# Altium schematic sheet FullSystem.SchDoc
size A1
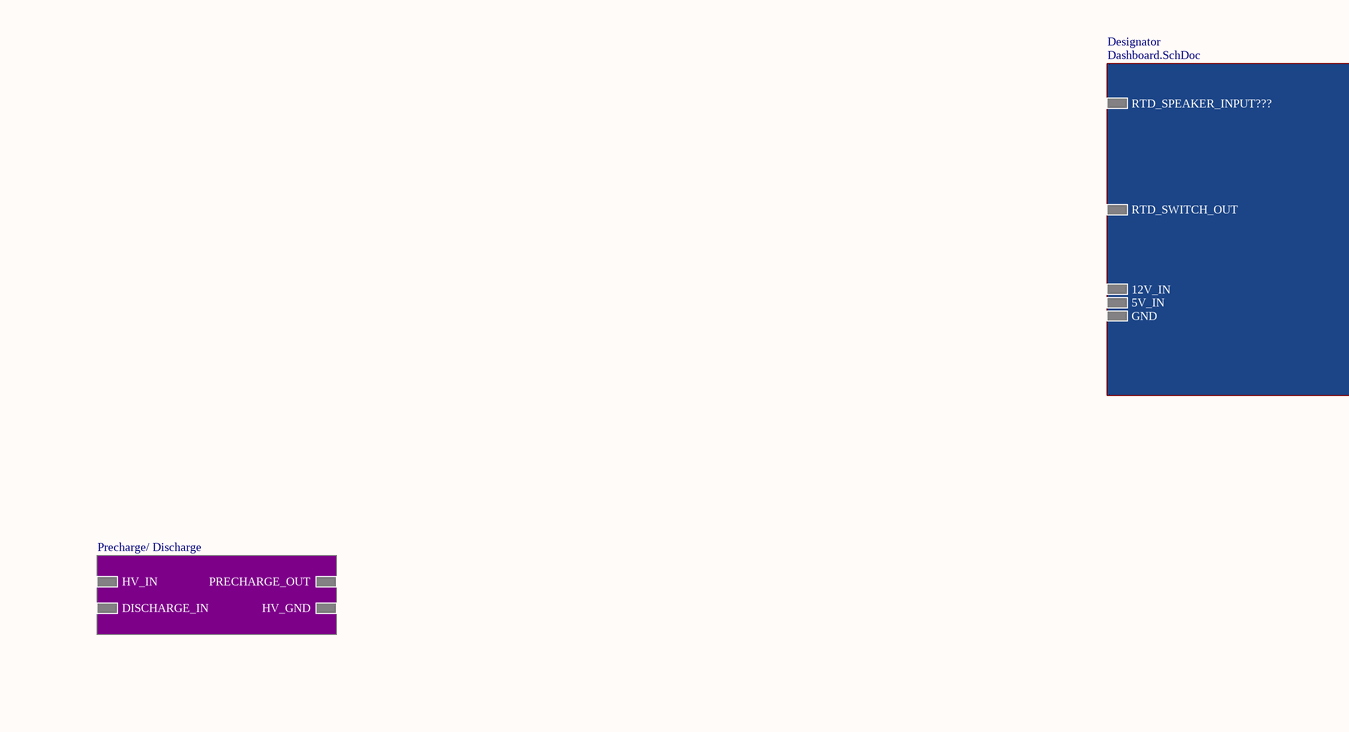
[diagram p0: FullSystem.SchDoc, top left]
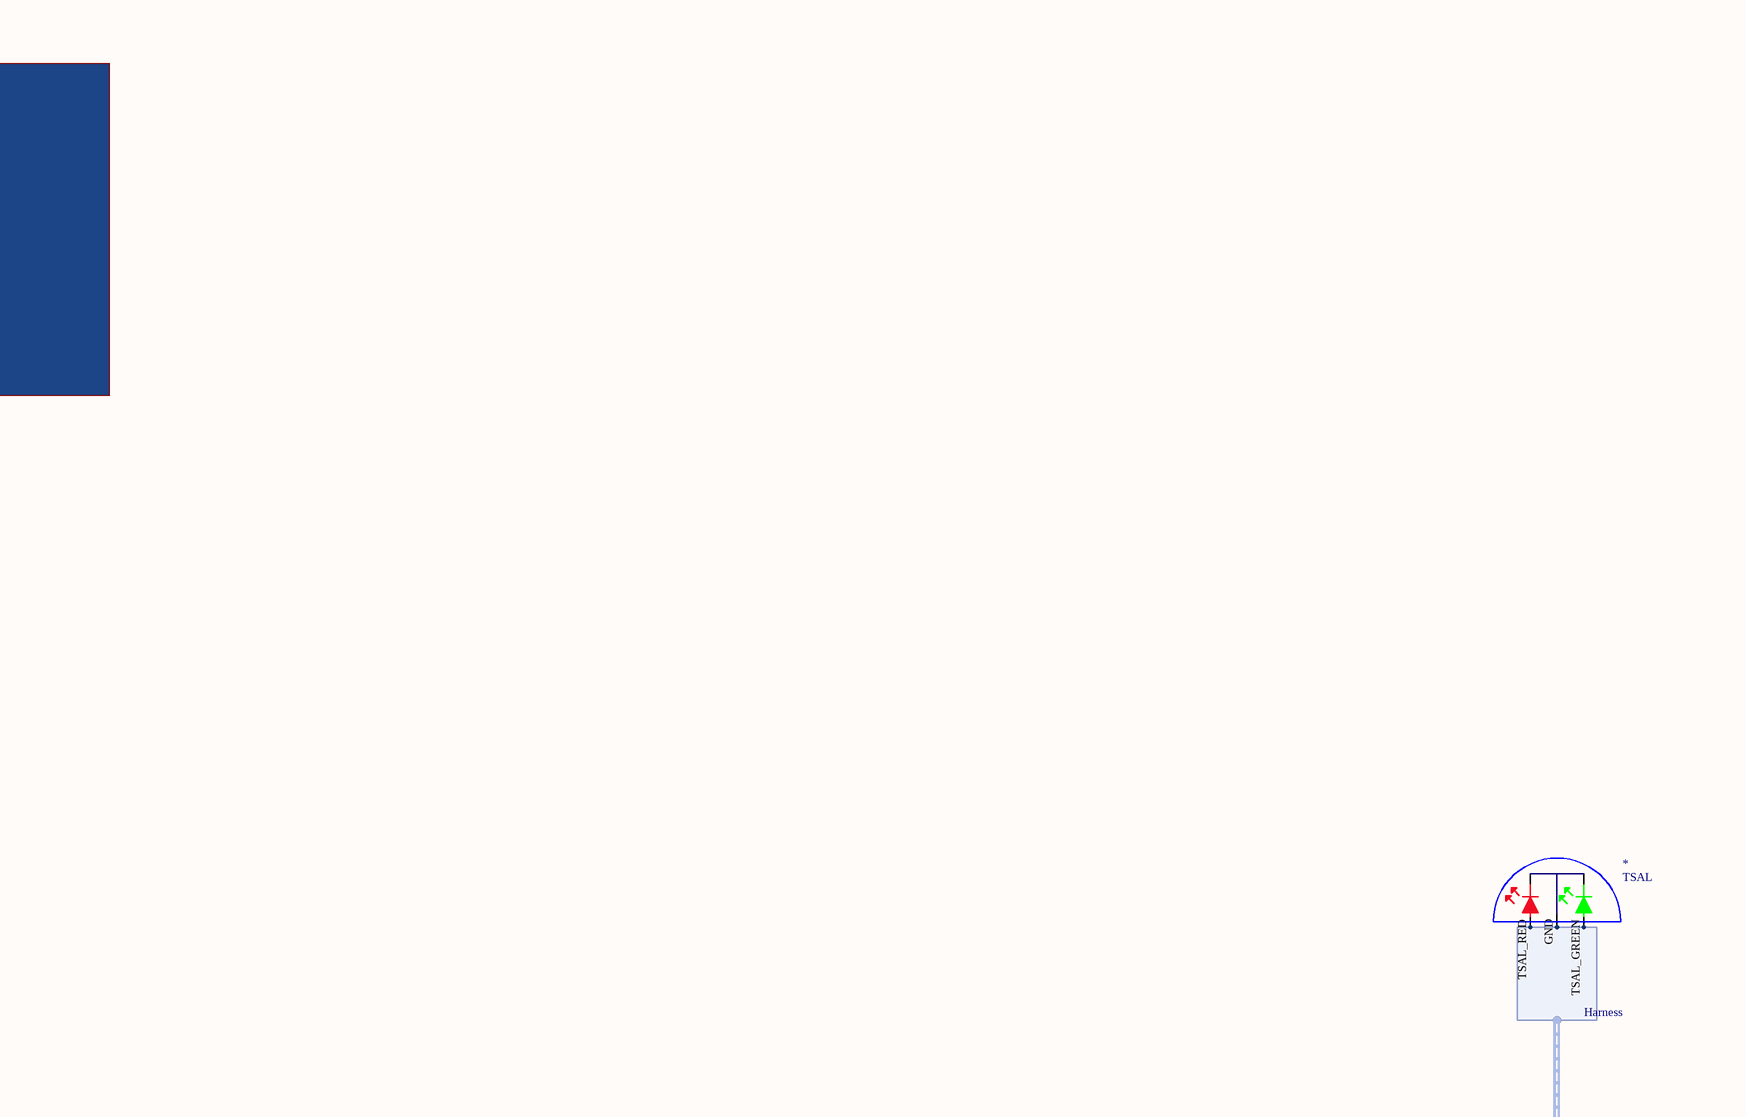
[diagram p1: FullSystem.SchDoc, top right]
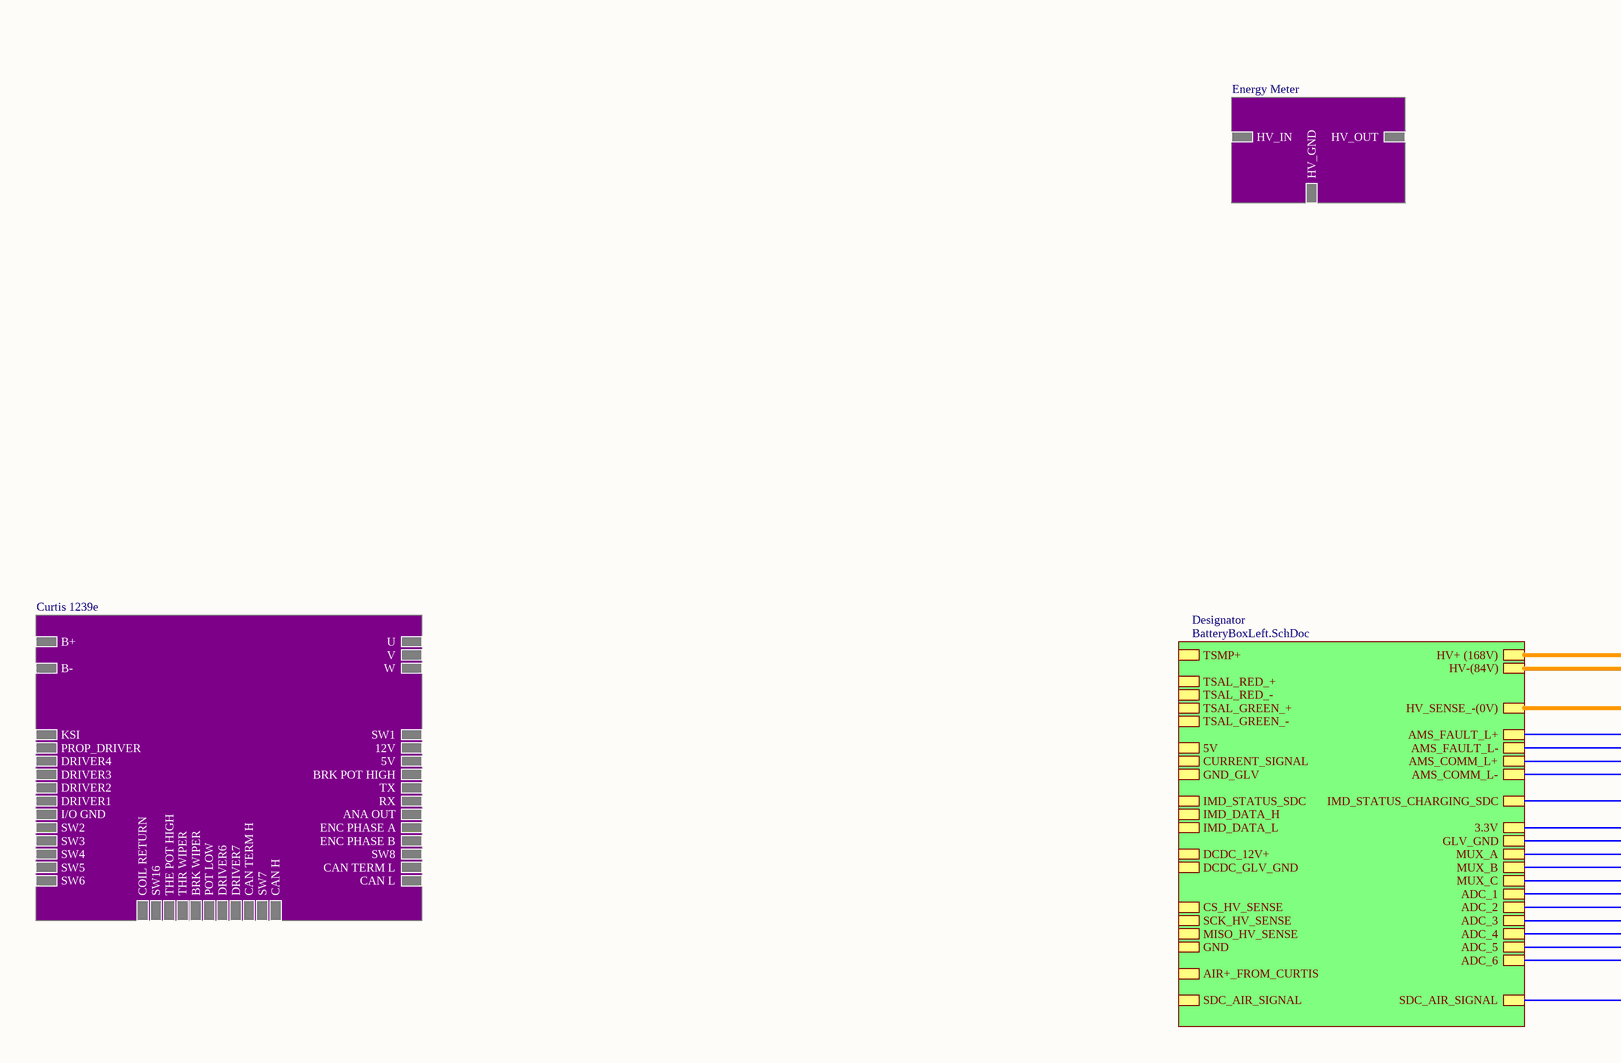
[diagram p2: FullSystem.SchDoc, bottom left]
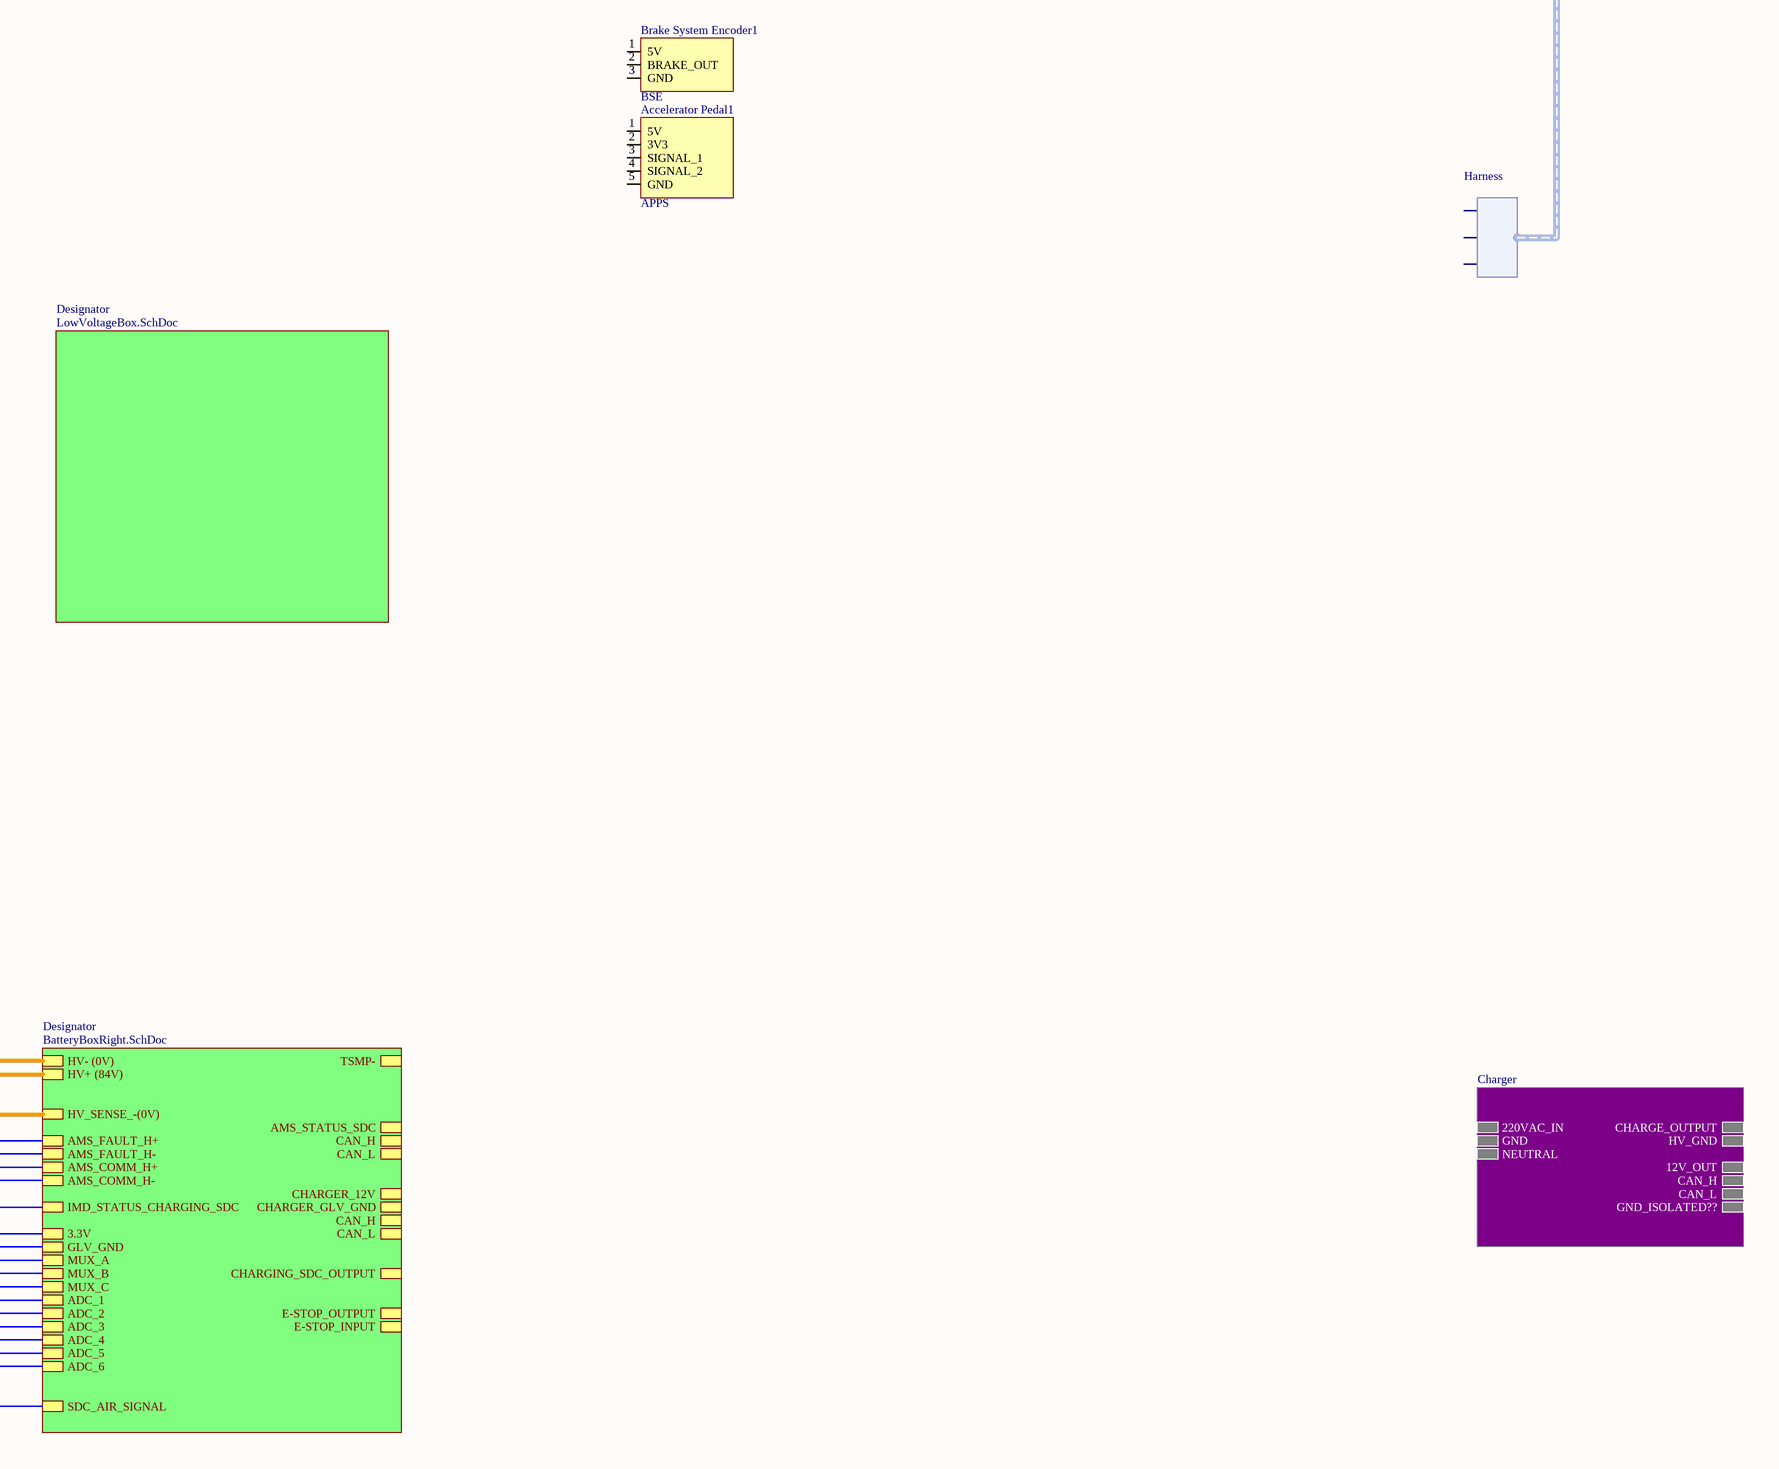
[diagram p3: FullSystem.SchDoc, bottom right]

## Parts
*  TSAL
Accelerator_Pedal1  APPS
Brake_System_Encoder1  BSE

## Sub-sheets
Charger = ?: 220VAC_IN, NEUTRAL, CHARGE_OUTPUT, 12V_OUT, CAN_H, CAN_L, GND_ISOLATED??, HV_GND, GND
Curtis 1239e = ?: B+, B-, U, V, W, DRIVER4, DRIVER3, DRIVER2, DRIVER1, I/O GND, SW2, SW3, SW4, SW5, SW6, COIL RETURN, SW16, THE POT HIGH, THR WIPER, BRK WIPER, POT LOW, DRIVER6, DRIVER7, CAN TERM H, SW7, CAN H, BRK POT HIGH, SW8, ENC PHASE B, ENC PHASE A, ANA OUT, RX, TX, 5V, PROP_DRIVER, 12V, KSI, SW1, CAN TERM L, CAN L
Designator = BatteryBoxLeft.SchDoc: HV+ (168V), HV-(84V), AMS_FAULT_L+, AMS_FAULT_L-, AMS_COMM_L+, AMS_COMM_L-, 3.3V, GLV_GND, MUX_A, MUX_B, MUX_C, ADC_1, ADC_2, ADC_3, ADC_4, ADC_5, ADC_6, 5V, CURRENT_SIGNAL, GND_GLV, IMD_STATUS_SDC, IMD_DATA_H, IMD_DATA_L, DCDC_12V+, DCDC_GLV_GND, TSMP+, IMD_STATUS_CHARGING_SDC, MISO_HV_SENSE, SCK_HV_SENSE, CS_HV_SENSE, HV_SENSE_-(0V), SDC_AIR_SIGNAL, SDC_AIR_SIGNAL, AIR+_FROM_CURTIS, TSAL_RED_+, TSAL_RED_-, TSAL_GREEN_+, TSAL_GREEN_-, GND
Designator = LowVoltageBox.SchDoc: no entries
Designator = Dashboard.SchDoc: RTD_SPEAKER_INPUT???, RTD_SWITCH_OUT, 12V_IN, 5V_IN, GND
Designator = BatteryBoxRight.SchDoc: HV- (0V), HV+ (84V), AMS_FAULT_H+, AMS_FAULT_H-, AMS_COMM_H+, AMS_COMM_H-, CAN_H, CAN_L, 3.3V, GLV_GND, MUX_A, MUX_B, MUX_C, ADC_1, ADC_2, ADC_3, ADC_4, ADC_5, ADC_6, TSMP-, IMD_STATUS_CHARGING_SDC, HV_SENSE_-(0V), CHARGER_12V, CHARGER_GLV_GND, CHARGING_SDC_OUTPUT, AMS_STATUS_SDC, SDC_AIR_SIGNAL, E-STOP_INPUT, E-STOP_OUTPUT, CAN_H, CAN_L
Energy Meter = ?: HV_IN, HV_GND, HV_OUT
Precharge/ Discharge = ?: HV_IN, DISCHARGE_IN, PRECHARGE_OUT, HV_GND

## Harnesses
Harness: , , 
Harness: 

## Nets
Net*_GND: *.GND *.TSAL_GREEN *.TSAL_RED ; harness Harness.
(unnamed): sheet Designator/HV-(84V), sheet Designator/HV+ (84V)
(unnamed): sheet Designator/AMS_FAULT_L+, sheet Designator/AMS_FAULT_H+
(unnamed): sheet Designator/AMS_FAULT_L-, sheet Designator/AMS_FAULT_H-
(unnamed): sheet Designator/AMS_COMM_L+, sheet Designator/AMS_COMM_H+
(unnamed): sheet Designator/AMS_COMM_L-, sheet Designator/AMS_COMM_H-
(unnamed): sheet Designator/3.3V, sheet Designator/3.3V
(unnamed): sheet Designator/GLV_GND, sheet Designator/GLV_GND
(unnamed): sheet Designator/MUX_A, sheet Designator/MUX_A
(unnamed): sheet Designator/MUX_B, sheet Designator/MUX_B
(unnamed): sheet Designator/MUX_C, sheet Designator/MUX_C
(unnamed): sheet Designator/ADC_1, sheet Designator/ADC_1
(unnamed): sheet Designator/ADC_2, sheet Designator/ADC_2
(unnamed): sheet Designator/ADC_3, sheet Designator/ADC_3
(unnamed): sheet Designator/ADC_4, sheet Designator/ADC_4
(unnamed): sheet Designator/ADC_5, sheet Designator/ADC_5
(unnamed): sheet Designator/ADC_6, sheet Designator/ADC_6
(unnamed): sheet Designator/IMD_STATUS_CHARGING_SDC, sheet Designator/IMD_STATUS_CHARGING_SDC
(unnamed): sheet Designator/HV_SENSE_-(0V), sheet Designator/HV_SENSE_-(0V)
(unnamed): sheet Designator/SDC_AIR_SIGNAL, sheet Designator/SDC_AIR_SIGNAL

Not connected (* = marked no-connect by the designer): * 2; Accelerator_Pedal1 1(5V) 2(3V3) 3(SIGNAL_1) 4(SIGNAL_2) 5(GND); Brake_System_Encoder1 1(5V) 2(BRAKE_OUT) 3(GND)